# EAGLE schematic spring_2020_swarm (EAGLE 9.5.2)
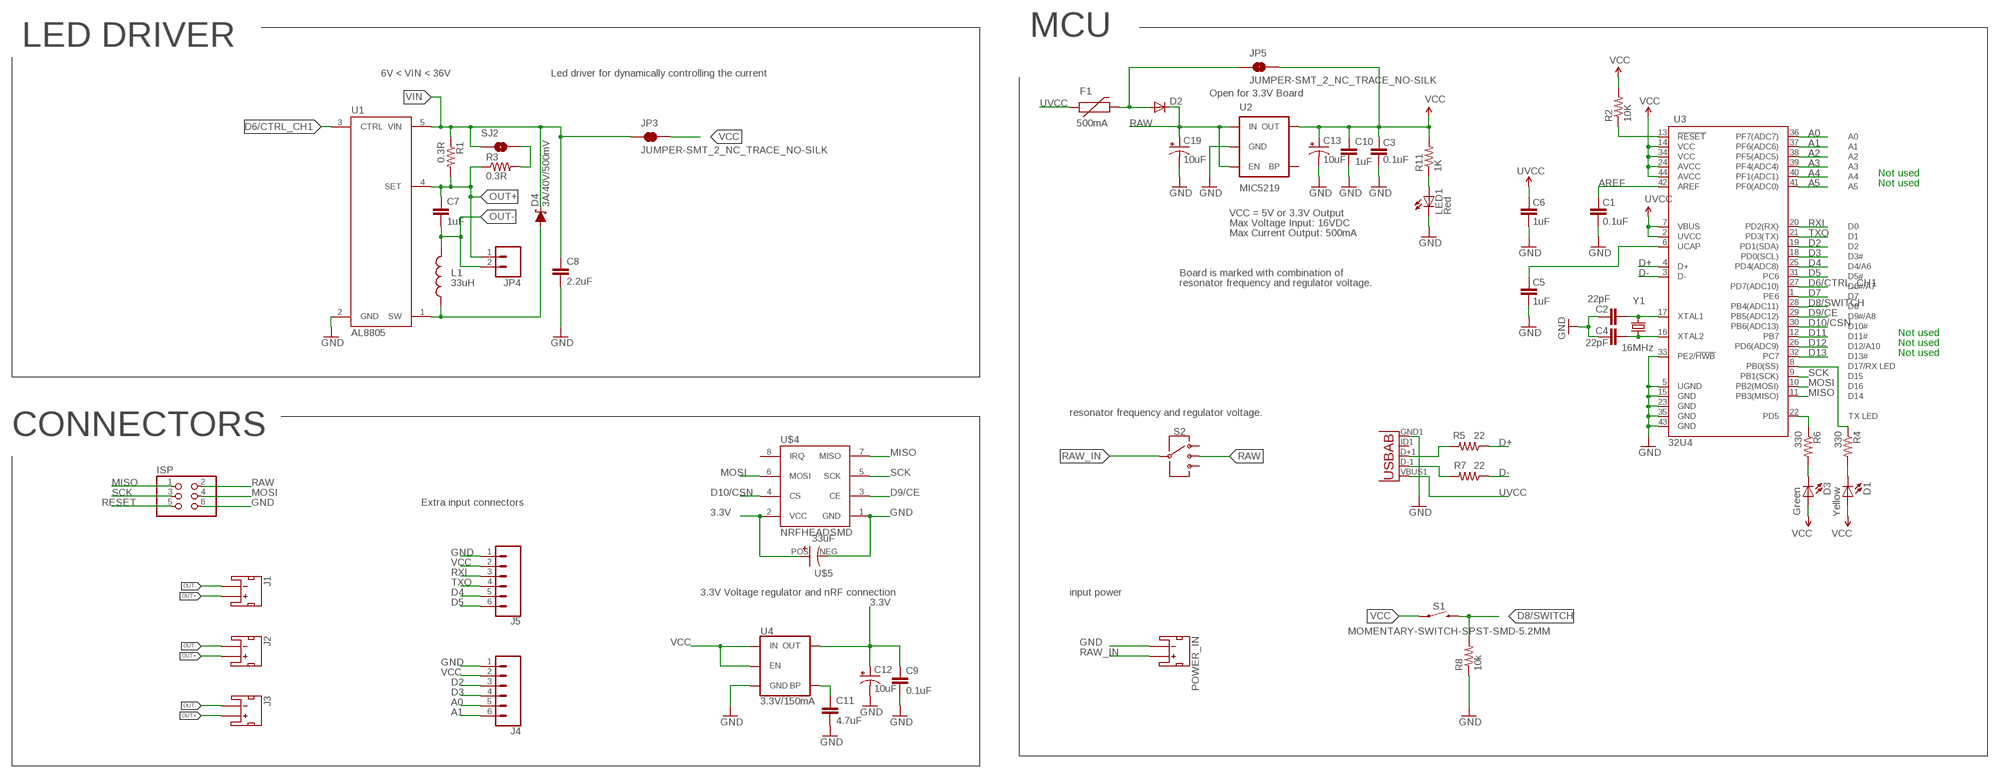
[diagram p0: schematic, sheet 1]

## Parts
C1  0.1uF  CAP0603-CAP  [0603-CAP]
C2  22pF  CAP0603-CAP  [0603-CAP]
C3  0.1uF  CAP0603-CAP  [0603-CAP]
C4  22pF  CAP0603-CAP  [0603-CAP]
C5  1uF  CAP0603-CAP  [0603-CAP]
C6  1uF  CAP0603-CAP  [0603-CAP]
C7  1uF  1.0UF50V10%(1206)  [1206-CAP]
C8  2.2uF  2.2UF50V10%(1206)  [1206-CAP]
C9  0.1uF  0.1UF-0603-25V-5%  [0603]
C10  1uF  CAP0603-CAP  [0603-CAP]
C11  4.7uF  4.7UF0603  [0603]
C12  10uF  CAP_POL1206  [EIA3216]
C13  10uF  CAP_POL1206  [EIA3216]
C19  10uF  CAP_POL1206  [EIA3216]
D1  Yellow  LED0603  [LED-0603]
D2  DIODESOD  [SOD-323]
D3  Green  LED0603  [LED-0603]
D4  3A/40V/500mV  DIODE-SCHOTTKY-B340A  [SMA-DIODE]
F1  500mA  PTCSMD  [PTC-1206]
ISP  PINHD-2X3-SMD  [2X03SMD]
J1  JST_2MM_MALE  [JST-2-SMD]
J2  JST_2MM_MALE  [JST-2-SMD]
J3  JST_2MM_MALE  [JST-2-SMD]
J4  CONN_06SMD-1MM  [1X06-1MM]
J5  CONN_06SMD-1MM  [1X06-1MM]
JP3  JUMPER-SMT_2_NC_TRACE_NO-SILK  [SMT-JUMPER_2_NC_TRACE_NO-SILK]
JP4  CONN_02  [1X02]
JP5  JUMPER-SMT_2_NC_TRACE_NO-SILK  [SMT-JUMPER_2_NC_TRACE_NO-SILK]
L1  33uH  INDUCTORBOURNS_SRN6045  [SRN6045]
LED1  Red  LED0603  [LED-0603]
POWER_IN  JST_2MM_MALE  [JST-2-SMD]
R1  0.3R  0.3OHM-1/8W-1%(0805)  [0805]
R2  10K  RESISTOR0603-RES  [0603-RES]
R3  0.3R  0.3OHM-1/8W-1%(0805)  [0805]
R4  330  RESISTOR0603-RES  [0603-RES]
R5  22  RESISTOR0603-RES  [0603-RES]
R6  330  RESISTOR0603-RES  [0603-RES]
R7  22  RESISTOR0603-RES  [0603-RES]
R8  10k  RESISTOR0603-RES  [0603-RES]
R11  1K  RESISTOR0603-RES  [0603-RES]
S1  MOMENTARY-SWITCH-SPST-SMD-5.2MM  [TACTILE_SWITCH_SMD_5.2MM]
S2  SWITCH-SP3T-SMD  [SWITCH_SP3T_SMD]
SJ2  NO Jumper  JUMPER-PAD-2-NO  [PAD-JUMPER-2-NO_NO_SILK]
U1  AL8805  [SOT23-5]
U2  MIC5219  V_REG_LDOSMD  [SOT23-5]
U3  32U4  ATMEGA32U4TQFP-44  [TQFP44]
U4  3.3V/150mA  V_REG_MIC52053.3V  [SOT23-5]
U$4  NRFHEADSMD  [2.54MM]
U$5  33uF  POLCAP-PANASONIC-SMD-C  [PANASONIC-CAP-SMD-C]
X1  USB-ABIN&OUT  [USB-AB-MICRO-SMD-V03-IN&OUT]
Y1  16MHz  CRYSTAL5X3  [CRYSTAL-SMD-5X3]

## Nets
3.3V: C9.1 C12.A(+) U4.5(OUT) U$4.2(VCC) U$5.POS(+)
A0: J4.5 U3.36(PF7(ADC7))
A1: J4.6 U3.37(PF6(ADC6))
A2: U3.38(PF5(ADC5))
A3: U3.39(PF4(ADC4))
A4: U3.40(PF1(ADC1))
A5: U3.41(PF0(ADC0))
AREF: C1.2 U3.42(AREF)
D2: J4.3 U3.19(PD1(SDA))
D3: J4.4 U3.18(PD0(SCL))
D4: J5.5 U3.25(PD4(ADC8))
D5: J5.6 U3.31(PC6)
D6/CTRL_CH1: U1.3(CTRL) U3.27(PD7(ADC10))
D7: U3.1(PE6)
D8/SWITCH: R8.2 S1.3 U3.28(PB4(ADC11))
D9/CE: U3.29(PB5(ADC12)) U$4.3(CE)
D10/CSN: U3.30(PB6(ADC13)) U$4.4(CS)
D11: U3.12(PB7)
D12: U3.26(PD6(ADC9))
D13: U3.32(PC7)
D+: R5.1 U3.4(D+)
D-: R7.1 U3.3(D-)
GND: C1.1 C2.2 C3.1 C4.2 C5.1 C6.1 C8.2 C9.2 C10.2 C11.2 C12.C(-) C13.C(-) C19.C(-) ISP.6 J4.1 J5.1 LED1.C POWER_IN.1(-) R8.1 U1.2(GND) U2.2(GND) U3.5(UGND) U3.15(GND) U3.23(GND) U3.33(PE2/!HWB) U3.35(GND) U3.43(GND) U4.2(GND) U$4.1(GND) U$5.NEG(-) X1.GND1(GND)
MISO: ISP.1 U3.11(PB3(MISO)) U$4.7(MISO)
MOSI: ISP.4 U3.10(PB2(MOSI)) U$4.6(MOSI)
N$1: C4.1 U3.16(XTAL2) Y1.1
N$2: C2.1 U3.17(XTAL1) Y1.3
N$3: D2.2(A) F1.2 JP5.1
N$4: C5.2 U3.6(UCAP)
N$5: D1.C R4.2
N$6: R7.2 X1.D-1(D-)
N$7: D3.C R6.2
N$8: R5.2 X1.D+1(D+)
N$9: R3.2 SJ2.2
N$12: R4.1 U3.8(PB0(SS))
N$13: C11.1 U4.4(BP)
N$38: LED1.A R11.1
OUT+: C7.1 J1.2(+) J2.2(+) J3.2(+) JP4.1 R1.2 R3.1 U1.4(SET)
OUT-: C7.2 J1.1(-) J2.1(-) J3.1(-) JP4.2 L1.2
RAW [power]: C19.A(+) D2.1(C) ISP.2 S2.2 U2.1(IN) U2.3(EN)
RAW_IN: POWER_IN.2(+) S2.3
RESET: ISP.5 R2.1 U3.13(!RESET)
RXI: J5.3 U3.20(PD2(RX))
SCK: ISP.3 U3.9(PB1(SCK)) U$4.5(SCK)
SW: D4.A L1.1 U1.1(SW)
TXLED: R6.1 U3.22(PD5)
TXO: J5.4 U3.21(PD3(TX))
UVCC: C6.2 F1.1 U3.2(UVCC) U3.7(VBUS) X1.VBUS1(VBUS)
VCC: C3.2 C10.1 C13.A(+) D1.A D3.A J4.2 J5.2 JP3.2 JP5.2 R2.2 R11.2 S1.1 U2.5(OUT) U3.14(VCC) U3.24(AVCC) U3.34(VCC) U3.44(AVCC) U4.1(IN) U4.3(EN)
VIN: C8.1 D4.C JP3.1 R1.1 SJ2.1 U1.5(VIN)
Unconnected: J1.NC1(PAD1) J1.NC2(PAD2) J2.NC1(PAD1) J2.NC2(PAD2) J3.NC1(PAD1) J3.NC2(PAD2) POWER_IN.NC1(PAD1) POWER_IN.NC2(PAD2) S2.1 S2.4 U2.4(BP) U$4.8(IRQ) X1.ID1(USBID)

## Notes on the sheet
- LED DRIVER | MCU
- 6V < VIN < 36V | Led driver for dynamically controlling the current
- Open for 3.3V Board
- Not used
- Not used
- VCC = 5V or 3.3V Output
- Max Voltage Input: 16VDC
- Max Current Output: 500mA
- Board is marked with combination of
- resonator frequency and regulator voltage.
- Not used
- Not used
- Not used
- resonator frequency and regulator voltage.
- CONNECTORS
- Extra input connectors
- 3.3V Voltage regulator and nRF connection | input power

## Library data of the parts
C1-C6 C10 = SparkFun:CAP: Capacitor Standard 0603 ceramic capacitor, and 0.1" leaded capacitor.
C7 = SparkFun-Capacitors:1.0UF50V10%(1206): CAP-09822
C8 = SparkFun-Capacitors:2.2UF50V10%(1206): CAP-10009
C9 = SparkFun-Capacitors:0.1UF: 0.1µF ceramic capacitors A capacitor is a passive two-terminal electrical component used to store electrical energy temporarily in an electric field.; PROD_ID: CAP-08604
C11 = SparkFun-Capacitors:4.7UF: 4.7µF ceramic capacitors A capacitor is a passive two-terminal electrical component used to store electrical energy temporarily in an electric field.; PROD_ID: CAP-08280
C12 C13 C19 = SparkFun:CAP_POL: Capacitor Polarized These are standard SMD and PTH capacitors. Normally 10uF, 47uF, and 100uF in electrolytic and tantalum varieties. Always verify the external diameter of the through hole cap, it varies with capacity, voltage, and manufacturer. The EIA devices should be standard.
D1 D3 LED1 = SparkFun:LED: LEDs Standard schematic elements and footprints for 5mm, 3mm, 1206, and 0603 sized LEDs. 5mm - Spark Fun Electronics SKU : COM-00529 (and others)
D2 = SparkFun:DIODE: Diode These are standard reverse protection diodes and small signal diodes. SMA package can handle up to about 1A. SOD-323 can handle about 200mA. What the SOD-323 package when ordering, there are some mfgs out there that are 5-pin packages.
D4 = SparkFun-DiscreteSemi:DIODE-SCHOTTKY: Schottky diode A Schottky diode is a semiconductor diode which has a low forward voltage drop and a very fast switching action.; PROD_ID: DIO-09886
F1 = SparkFun:PTC: Resettable Fuse PTC Resettable Fuse. Spark Fun Electronics SKU : COM-08357
ISP = fab:PINHD-2X3-SMD: PIN HEADER
J1-J3 POWER_IN = SparkFun-Connectors:JST_2MM_MALE: JST 2MM MALE RA CONNECTOR Two pin, compact surface mount connector. Commonly used as a battery input connection point. We really like the solid locking feeling and high current rating on these small connectors. We use these all the time as battery connectors. Mates to single-cell LiPo batteries. Here is the connector we sell at SparkFun: JST Right Angle Connector - White <https://www.sparkfun.com/products/8612> (PRT-08612) Datasheet <http://www.sparkfun.com/datasheets/Prototyping/Connectors/JST-Horizontal.pdf> It was used on these SparkFun products: SparkFun MOSFET Power Controller <https://www.sparkfun.com/products/11214> (PRT-11214) SparkFun Battery Babysitter - LiPo Battery Manager <https://www.sparkfun.com/products/13777> (PRT-13777) And many, many others that required a lipo battery connection.; PROD_ID: CONN-11443; SF_ID: PRT-08612
J4 J5 = SparkFun-Connectors:CONN_06: Multi connection point. Often used as Generic Header-pin footprint for 0.1 inch spaced/style header connections On any of the 0.1 inch spaced packages, you can populate with these: Break Away Headers - Straight <https://www.sparkfun.com/products/116> (PRT-00116) Break Away Male Headers - Right Angle <https://www.sparkfun.com/products/553> (PRT-00553) Female Headers <https://www.sparkfun.com/products/115> (PRT-00115) Break Away Headers - Machine Pin <https://www.sparkfun.com/products/117> (PRT-00117) Break Away Female Headers - Swiss Machine Pin <https://www.sparkfun.com/products/743> (PRT-00743) Arduino Stackable Header - 6 Pin <https://www.sparkfun.com/products/9280> (PRT-09280) For SCREWTERMINALS and SPRING TERMINALS visit here: Screw Terimnals on SparkFun.com <https://www.sparkfun.com/search/results?term=Screw+Terminals> (5mm/3.5mm/2.54mm spacing) This device is also useful as a general connection point to wire up your design to another part of your project. Our various solder wires solder well into these plated through hole pads. Hook-Up Wire - Assortment (Stranded, 22 AWG) <https://www.sparkfun.com/products/11375> (PRT-11375) Hook-Up Wire - Assortment (Solid Core, 22 AWG) <https://www.sparkfun.com/products/11367> (PRT-11367) View the entire wire category on our website here <https://www.sparkfun.com/categories/141>; PROD_ID: CONN-08249; SF_ID: GPS-00579
JP3 JP5 = SparkFun-Jumpers:JUMPER-SMT_2_NC_TRACE: Normally closed trace jumper This jumper has a trace between two pads so it's normally closed (NC). Use a razor knife to open the connection. For best results follow the IPC guidelines for cutting traces: Cutout at least 0.063 mm (0.005 in). Remove all loose material to clean up the cut area. Seal the cut with an approved epoxy. Reapply solder to reclose the connection.
JP4 = SparkFun-Connectors:CONN_02: Multi connection point. Often used as Generic Header-pin footprint for 0.1 inch spaced/style header connections On any of the 0.1 inch spaced packages, you can populate with these: Break Away Headers - Straight <https://www.sparkfun.com/products/116> (PRT-00116) Break Away Male Headers - Right Angle <https://www.sparkfun.com/products/553> (PRT-00553) Female Headers <https://www.sparkfun.com/products/115> (PRT-00115) Break Away Headers - Machine Pin <https://www.sparkfun.com/products/117> (PRT-00117) Break Away Female Headers - Swiss Machine Pin <https://www.sparkfun.com/products/743> (PRT-00743) For SCREWTERMINALS and SPRING TERMINALS visit here: Screw Terimnals on SparkFun.com <https://www.sparkfun.com/search/results?term=Screw+Terminals> (5mm/3.5mm/2.54mm spacing) This device is also useful as a general connection point to wire up your design to another part of your project. Our various solder wires solder well into these plated through hole pads. Hook-Up Wire - Assortment (Stranded, 22 AWG) <https://www.sparkfun.com/products/11375> (PRT-11375) Hook-Up Wire - Assortment (Solid Core, 22 AWG) <https://www.sparkfun.com/products/11367> (PRT-11367) View the entire wire category on our website here <https://www.sparkfun.com/categories/141> Special notes: Molex polarized connector foot print use with: PRT-08233 with associated crimp pins and housings. 2.54_SCREWTERM for use with PRT-10571. 3.5mm Screw Terminal footprints for PRT-08084 5mm Screw Terminal footprints for use with PRT-08432
L1 = SparkFun-Passives:INDUCTOR: Inductors Basic Inductor/Choke - 0603 and 1206. Footprints are not proven and vary greatly between part numbers. INDUCTOR POWER 3.3UH 4.0A SMD 0.197" L x 0.197" W x 0.177" H (5.00mm x 5.00mm x 4.50mm); PROD_ID: NDUC-11627
R1 R3 = SparkFun-Resistors:0.3OHM-1/8W-1%(0805): RES-11622; PROD_ID: RES-11622; VALUE: 0.3
R2 R4-R8 R11 = SparkFun:RESISTOR: Resistor Basic schematic elements and footprints for 0603, 1206, and PTH resistors.
S1 = SparkFun-Switches:MOMENTARY-SWITCH-SPST: Momentary Switch (Pushbutton) - SPST Normally-open (NO) SPST momentary switches (buttons, pushbuttons). Variants PTH-12MM - 12mm square, through-hole Momentary Pushbutton Switch - 12mm Square <https://www.sparkfun.com/products/9190> (COM-09190) PTH-6.0MM, PTH-6.0MM-KIT - 6.0mm square, through-hole Mini Pushbutton Switch <https://www.sparkfun.com/products/97> (COM-00097) KIT package intended for soldering kit's - only one side of pads' copper is exposed. PTH-RIGHT-ANGLE-KIT - Right-angle, through-hole Right Angle Tactile Button <https://www.sparkfun.com/products/10791> - Used on SparkFun BigTime Watch Kit <https://www.sparkfun.com/products/11734> SMD-12MM - 12mm square, surface-mount Tactile Button - SMD (12mm) <https://www.sparkfun.com/products/12993> (COM-12993) Used on SparkFun PicoBoard <https://www.sparkfun.com/products/11888> SMD-4.5MM - 4.5mm Square Trackball Switch Used on SparkFun Blackberry Trackballer Breakout <https://www.sparkfun.com/products/13169> SMD-4.6MMX2.8MM - 4.60mm x 2.80mm, surface mount Used on SparkFun SAMD21 Mini Breakout <https://www.sparkfun.com/products/13664> SMD-5.2MM, SMD-5.2-REDUNDANT - 5.2mm square, surface-mount Mini Pushbutton Switch - SMD <https://www.sparkfun.com/products/8720> (COM-08720) Used on Arduino Pro Mini <https://www.sparkfun.com/products/11114> REDUNDANT package connects both switch circuits together SMD-6.0X3.5MM - 6.0 x 3.5mm, surface mount Momentary Reset Switch SMD <https://www.sparkfun.com/products/8229> (COM-08229) SMD-6.2MM-TALL - 6.2mm square, surface mount Tactile Button - SMD (6mm) <https://www.sparkfun.com/products/12992> Used on SparkFun Digital Sandbox <https://www.sparkfun.com/products/12651> SMD-RIGHT-ANGLE - Right-angle, surface mount Used on SparkFun Block for Intel® Edison - Arduino <https://www.sparkfun.com/products/13036>; PROD_ID: SWCH-08247; SF_SKU: COM-08720
S2 = SparkFun-Switches:SWITCH-SP3T: Single-Pole, Triple-Throw (SP3T) Switch Single-Pole, Triple-Throw switches SparkFun Products Prototype Part; PROD_ID: SWCH-10805
SJ2 = SparkFun-Passives:JUMPER-PAD-2-NO
U1 = SparkFun-PowerIC:AL8805: Constant current LED driver PWM-able 1MHz switch freq 6V-36V Up to 1A LED current; PROD_ID: IC-11626; VALUE: AL8805WS
U2 = SparkFun:V_REG_LDO: Voltage Regulator LDO Standard 150mA LDO voltage regulator in SOT-23 layout. Micrel part MIC5205. BP (by-pass) pin is used to lower output noise with 470pF cap.
U3 = SparkFun-IC-Microcontroller:ATMEGA32U4: Atmel MCU, 32KByte Atmel 44-pin 8-bit Microcontroller with 32KBytes of ISP Flash and USB Controller Datasheet <http://cdn.sparkfun.com/datasheets/Dev/Arduino/Boards/ATMega32U4.pdf> SparkFun Products LilyPad Arduino USB - ATmega32U4 Board <https://www.sparkfun.com/products/12049> (DEV-12049) Pro Micro - 5V/16MHz <https://www.sparkfun.com/products/12640> (DEV-12640) Pro Micro - 3.3V/8MHz <https://www.sparkfun.com/products/12587> (DEV-12587) Fio v3 - ATmega32U4 <https://www.sparkfun.com/products/11520> (DEV-11520) Qduino Mini <https://www.sparkfun.com/products/13614> (DEV-13614) Makey Makey - Standard Kit <https://www.sparkfun.com/products/11511> (WIG-11511) Makey Makey Deluxe Kit <https://www.sparkfun.com/products/11519> (WIG-11519); PROD_ID: IC-11161
U4 = SparkFun-IC-Power:V_REG_MIC5205: V_REG MIC5205 Standard 3.3V, 5V, and Adjustable 150mA LDO voltage regulator in SOT-23 layout. Micrel part MIC5205. BP (by-pass) pin is used to lower output noise with 470pF cap, may be left open. On the adjustable version BP is used to set output.; PROD_ID: VREG-00822
U$4 = nrf:NRFHEAD
U$5 = talkingdrums:POLCAP-PANASONIC-SMD-C
X1 = Testing:USB-AB: This is a USB AB connector that is compatible with USB OTG. i.e. this connector can serve as a host or device
Y1 = SparkFun:CRYSTAL: Crystals Various standard crystals. Proven footprints. Spark Fun Electronics SKU : COM-00534

## Net classes
1 power: width 0.508 mm